# Altium schematic sheet GPS.SchDoc
size B; SheetNumber: 4; SheetTotal: 8
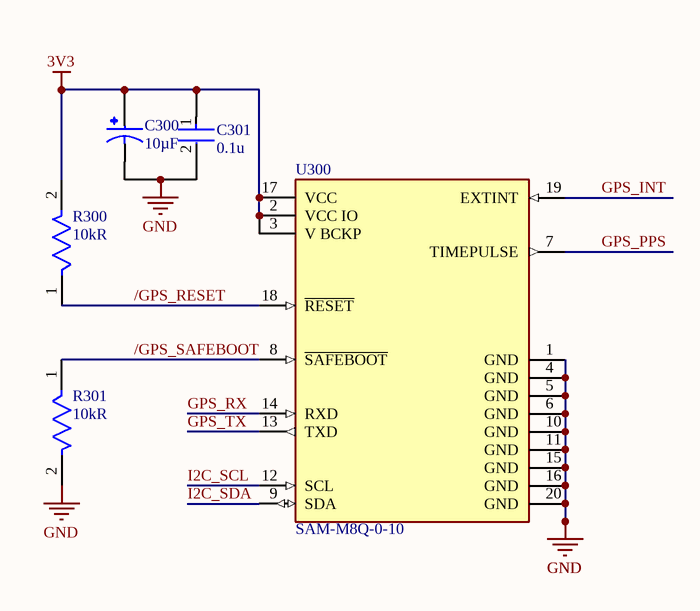
[diagram p0: GPS.SchDoc]

## Parts
C300  value 10µF  [CAP_EEEFN1C100R]  (hidden comment: EEEFN1C100R)
C301  Capacitance: 0.1u  [FP-CL10-IPC_A]  (hidden comment: CL10C681JB8NFNC)
R300  value 10kR  [FP-CPF0603-MFG]  (hidden comment: CPF0603B2K15E1)
R301  value 10kR  [FP-CPF0603-MFG]  (hidden comment: CPF0603B2K15E1)
U300  SAM-M8Q-0-10  [FP-SAM-M8Q-0-10-MFG]

## Nets
3V3: C300.1 C301.1 R300.2 U300.2(VCC_IO) U300.3(V_BCKP) U300.17(VCC)
GND: C300.2 C301.2 R301.2 U300.1(GND) U300.4(GND) U300.5(GND) U300.6(GND) U300.10(GND) U300.11(GND) U300.15(GND) U300.16(GND) U300.20(GND)
/GPS_RESET: R300.1 U300.18(~{RESET})
/GPS_SAFEBOOT: R301.1 U300.8(~{SAFEBOOT})
GPS_INT: U300.19(EXTINT)
GPS_PPS: U300.7(TIMEPULSE)
GPS_RX: U300.14(RXD)
GPS_TX: U300.13(TXD)
I2C_SCL: U300.12(SCL)
I2C_SDA: U300.9(SDA)

## Library data of the parts
C300 = CMP-001-00085-1: 10ÂµF 16V Aluminum Electrolytic Capacitors Radial, Can - SMD 1.35Ohm @ 100kHz 2000 Hrs @ 105Â°C; MF: Panasonic; Digi-Key_Part_Number: 10-EEE-FN1C100RCT-ND; Design Item ID: EEEFN1C100R; Check_prices: https://www.snapeda.com/parts/EEEFN1C100R/Panasonic/view-part/5793981/?ref=eda; MP: EEEFN1C100R; Source: EEEFN1C100R.SchLib; Case/Package: RADIAL-2 Panasonic; Component Type: Standard; Pins: 2; SnapEDA_Link: https://www.snapeda.com/parts/EEEFN1C100R/Panasonic/view-part/5793981/?ref=snap
C301 = CMP-13271-001533-1: Cap Ceramic 680pF 50V C0G ±5% Pad SMD 0603 +125°C T/R; Voltage Rating: 50V; Radiation Hardening: No; Length: 0.063inch; Min Operating Temperature: -55°C; Package Quantity: 1; Lead Free: Lead Free; Case Code (Metric): 1608; Thickness: 0.035inch; Width: 0.031inch; Height: 0.8mm; Case/Package: 0603; Tolerance: 5%; Mount: Surface Mount; Dielectric: C0G; Max Operating Temperature: 125°C; Case Code (Imperial): 0603; Packaging: Tape and Reel; Depth: 0.8mm
R300 R301 = CMP-03211-008657-1: RES SMD 2.15KΩ 0.1% 1/16W 0603; Manufacturer: TE Connectivity; Temperature Coefficient: 25ppm/°C; Voltage Rating: 50V; Power Rating: 0.063W; Height: 0.55mm; Series: CPF; ComponentLink2Description: Datasheet; Package: CPF0603; Automotive: No; octopart_url: https://octopart.com/cpf0603b2k15e1-te+connectivity-22739551; Lead Free: Yes; Temperature: -55°C to +155°C; RoHS: TRUE; Ipc Land Pattern Name: RESC15580X45; Temperature Range Low: -55°C; Composition: Thin Film; Device Class L3: Chip SMD Resistors; Category: Res; Octopart: https://octopart.com/cpf0603b2k15e1-te+connectivity-22739551; Resistance: 2.15KΩ; ComponentLink2URL: https://www.te.com/commerce/DocumentDelivery/DDEController?Action=showdoc&DocId=Data+Sheet%7F1773200%7FM%7Fpdf%7FEnglish%7FENG_DS_1773200_M.pdf%7F3-1676481-2; Manufacturer Part Number: CPF0603B2K15E1; packaging: 1k Reel; Tolerance: 0.1%; Temperature Range High: +155°C; Device Class L1: Passive Components; Device Class L2: Resistors
U300 = CMP-207130-000004-3: RF RX GALILEO 1.575GHZ/1.602GHZ; Manufacturer: uBlox; Nominal Supply Current: 9.5-32mA; Sensitivity: -165dBm; Automotive Grade: Grade 3; Max Frequency: 1602MHz; Min Supply Voltage: 2.7V; Max Supply Voltage: 3.6V; Data Rate: 400kbits/s; Interface: I2C,UART,Other; Package: 0; ComponentLink2Description: Datasheet; Octopart: https://octopart.com/sam-m8q-0-10-u-blox-88247750; Temperature Range Low: -40°C; Height: 6.8mm; Category: IC; RoHS: TRUE; Digikey Description: RF RX GALILEO 1.575GHZ/1.602GHZ; Footprint Url: https://www.u-blox.com/sites/default/files/SAM-M8Q_HardwareIntegrationManual_%28UBX-16018358%29.pdf; ComponentLink2URL: https://www.u-blox.com/sites/default/files/SAM-M8Q_DataSheet_%28UBX-16012619%29.pdf; Temperature Range High: +85°C; Device Class L1: Integrated Circuits (ICs); Temperature: -40°C to +85°C; Automotive: Yes; Device Class L2: RF Semiconductors and Devices; Manufacturer Part Number: SAM-M8Q-0-10; Device Class L3: Transceivers; Lead Free: Yes